# Altium schematic sheet 13_TF卡.schdoc.schdoc
size 309 x 223 mm; Symbol: Sheet-Symbol_A4; Device: Sheet-Symbol_A4; @Page Name: TF卡; @Create Date: 2023-12-01; @Page Count: 6; @Page No: 6; @Project Name: STM32F722RET6; @Schematic Name: 开发板; @Update Date: 2023-12-01; Company: 嘉立创EDA; Page Size: A4; Version: V1.0
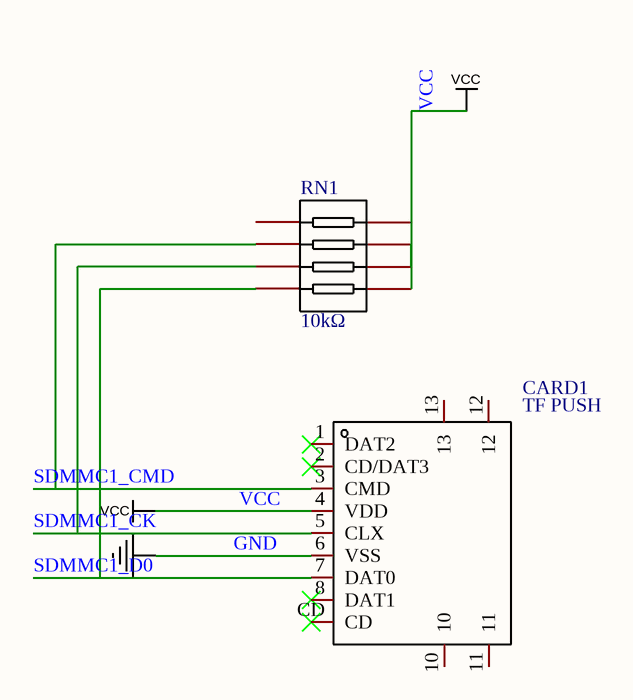
[diagram p0: 13_TF卡.schdoc.schdoc]

## Parts
CARD1  TF PUSH  [TF-SMD_TF-PUSH]
RN1  10kΩ  [RES-ARRAY-SMD_0603-8P-L3.2-W1.6-BL]

## Nets
GND: CARD1.6(VSS)
VCC: CARD1.4(VDD) RN1.5 RN1.6 RN1.7 RN1.8
SDMMC1_CK: CARD1.5(CLX) RN1.2
SDMMC1_CMD: CARD1.3(CMD) RN1.3
SDMMC1_D0: CARD1.7(DAT0) RN1.1

Not connected (* = marked no-connect by the designer): CARD1 1(DAT2)* 2(CD/DAT3)* 8(DAT1)* 10 11 12 13 CD*; RN1 4

## Notes on the sheet
- 1
- 2
- 3
- 4
- 5
- 6
- A
- B
- C
- 原理图
- 开发板
- 创建日期
- 更新日期
- 2023-12-01
- 审阅
- 绘制
- 图页
- TF卡
- 物料编码
- STM32F722RET6
- D
- 版本
- 尺寸
- 页
- 共
- V1.0
- A4
- 嘉立创EDA

## Library data of the parts
CARD1 = TF PUSH: 卡类型:MicroSD卡(TF卡);连接器类型:卡座;卡连接方式:自弹式;本体最大高度:2mm;工作温度范围:-20℃~+90℃;; Manufacturer: SHOU HAN(首韩); Add into BOM: yes; Connector Type: 卡座; Card Connection Mode: 自弹式; Maximum Body Height: 2mm; Name: TF PUSH; Symbol: TF PUSH; Device: TF PUSH; LCSC Part Name: 自弹式TF卡座 TF外焊式内存卡卡座; Supplier Part: C393941; Manufacturer Part: TF PUSH; Supplier Footprint: SMD; JLCPCB Part Class: 扩展库; Datasheet: https://atta.szlcsc.com/upload/public/pdf/source/20191011/C393941_0DDD896EE907FEB750D8B7B8982E2A67.pdf; Supplier: LCSC; Convert to PCB: yes; Card Type: MicroSD卡(TF卡); Operating Temperature Range: -20℃~+90℃
RN1 = YC164-JR-0710KL: 阻值:10kΩ;精度:±5%;单个元件功率:62.5mW;电阻器数:4;; Manufacturer: YAGEO(国巨); Add into BOM: yes; Tolerance: ±5%; Power(Watts): 62.5mW; Number of Resistors: 4; Temperature Coefficient: ±200ppm/℃; Name: 10kΩ; Symbol: YC164-JR-0710KL; Device: YC164-JR-0710KL; LCSC Part Name: 10kΩ ±5% 0603x4; Supplier Part: C107374; Manufacturer Part: YC164-JR-0710KL; Supplier Footprint: 0603x4; JLCPCB Part Class: 扩展库; Datasheet: https://atta.szlcsc.com/upload/public/pdf/source/20170418/1492506324305.pdf; Supplier: LCSC; Convert to PCB: yes; Value: 10kΩ; Number of Pins: 8